# EAGLE design usbuddy (EAGLE 6.5.0)
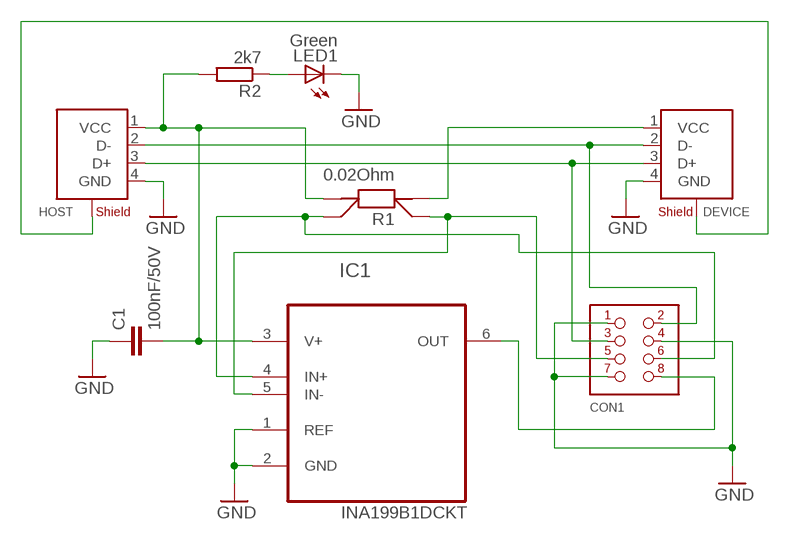
[diagram p0: schematic, sheet 1]

## Parts
C1  100nF/50V  C-EUC0603K  [C0603K]
CON1  PINHEAD-02X04-SMT-2.54  [2X04-SMT-PINHEAD]
DEVICE  USB-A-SMT  [USB-A-SMT-UBA-4R-S14HD-4S]
HOST  USB-B-SMT  [USB-B-SMT]
IC1  INA199A2DCKR  [SOT65P210X110-6N]
LED1  Green  LEDCHIP-LED0603  [CHIP-LED0603]
R1  0.02Ohm  LVK12  [1206-4WIRE]
R2  2k7  R-EU_R1206  [R1206]

## Nets
D+: CON1.3 DEVICE.3(D+) HOST.3(D+)
D-: CON1.2 DEVICE.2(D-) HOST.2(D-)
GND: C1.1 CON1.1 CON1.4 CON1.7 DEVICE.4(GND) HOST.4(GND) IC1.1(REF) IC1.2(GND) LED1.C
N$2: CON1.5 IC1.5(IN-) R1.V1
N$3: CON1.8 IC1.6(OUT)
N$8: DEVICE.1(VCC) R1.I1
N$9: CON1.6 IC1.4(IN+) R1.V2
N$10: LED1.A R2.1
SHIELD: DEVICE.S1(SHIELD) DEVICE.S2(SHIELD) DEVICE.S3(SHIELD) DEVICE.S4(SHIELD) HOST.S1(SHIELD) HOST.S2(SHIELD)
VBUS: C1.2 HOST.1(VCC) IC1.3(V+) R1.I2 R2.2

## Library data of the parts
C1 = rcl:C-EU: CAPACITOR, European symbol
CON1 = konektory:PINHEAD-02X04-SMT-2.54
DEVICE = konektory:USB-A-SMT: JST UBA-4R-S14HD-4S
HOST = konektory:USB-B-SMT: Tyco Electronics / TE connectivity 1734346
IC1 = Texas Instruments_By_element14_Batch_1:INA199A2DCKR: CURRENT SHUNT MONITOR; MPN: INA199B1DCKT; OC_FARNELL: -; OC_NEWARK: 74R6385; PACKAGE: SC70-6; SUPPLIER: Texas Instruments
LED1 = led:LED: LED OSRAM: - CHIPLED LG R971, LG N971, LY N971, LG Q971, LY Q971, LO R971, LY R971 LH N974, LH R974 LS Q976, LO Q976, LY Q976 LO Q996 - Hyper CHIPLED LW Q18S LB Q993, LB Q99A, LB R99A - SideLED LS A670, LO A670, LY A670, LG A670, LP A670 LB A673, LV A673, LT A673, LW A673 LH A674 LY A675 LS A676, LA A676, LO A676, LY A676, LW A676 LS A679, LY A679, LG A679 - Hyper Micro SIDELED® LS Y876, LA Y876, LO Y876, LY Y876 LT Y87S - SmartLED LW L88C, LW L88S LB L89C, LB L89S, LG L890 LS L89K, LO L89K, LY L89K LS L896, LA L896, LO L896, LY L896 - TOPLED LS T670, LO T670, LY T670, LG T670, LP T670 LSG T670, LSP T670, LSY T670, LOP T670, LYG T670 LG T671, LOG T671, LSG T671 LB T673, LV T673, LT T673, LW T673 LH T674 LS T676, LA T676, LO T676, LY T676, LB T676, LH T676, LSB T676, LW T676 LB T67C, LV T67C, LT T67C, LS T67K, LO T67K, LY T67K, LW E67C LS E67B, LA E67B, LO E67B, LY E67B, LB E67C, LV E67C, LT E67C LW T67C LS T679, LY T679, LG T679 LS T770, LO T770, LY T770, LG T770, LP T770 LB T773, LV T773, LT T773, LW T773 LH T774 LS E675, LA E675, LY E675, LS T675 LS T776, LA T776, LO T776, LY T776, LB T776 LHGB T686 LT T68C, LB T68C - Hyper Mini TOPLED® LB M676 - Mini TOPLED Santana® LG M470 LS M47K, LO M47K, LY M47K Source: http://www.osram.convergy.de LUXEON: - LUMILED® LXK2-PW12-R00, LXK2-PW12-S00, LXK2-PW14-U00, LXK2-PW14-V00 LXK2-PM12-R00, LXK2-PM12-S00, LXK2-PM14-U00 LXK2-PE12-Q00, LXK2-PE12-R00, LXK2-PE12-S00, LXK2-PE14-T00, LXK2-PE14-U00 LXK2-PB12-K00, LXK2-PB12-L00, LXK2-PB12-M00, LXK2-PB14-N00, LXK2-PB14-P00, LXK2-PB14-Q00 LXK2-PR12-L00, LXK2-PR12-M00, LXK2-PR14-Q00, LXK2-PR14-R00 LXK2-PD12-Q00, LXK2-PD12-R00, LXK2-PD12-S00 LXK2-PH12-R00, LXK2-PH12-S00 LXK2-PL12-P00, LXK2-PL12-Q00, LXK2-PL12-R00 Source: www.luxeon.com KINGBRIGHT: KA-3528ASYC Source: www.kingbright.com
R1 = pasivni:LVK12: Current shunt resistor Ohmite LVK12 series
R2 = rcl:R-EU_: RESISTOR, European symbol

## Board
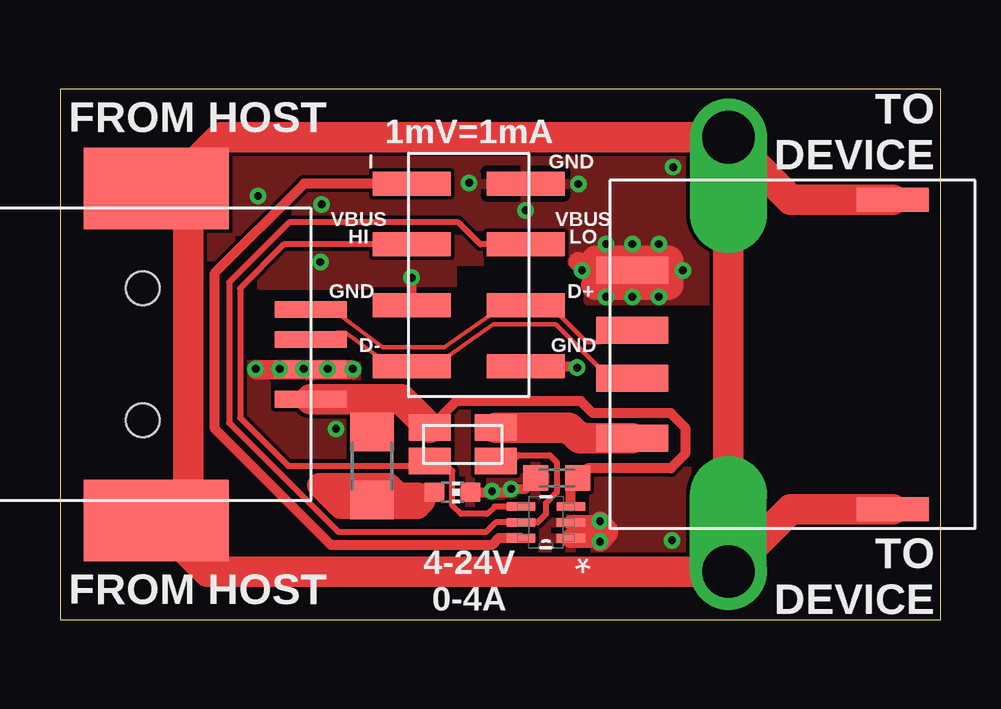
[diagram p1: board, top side]
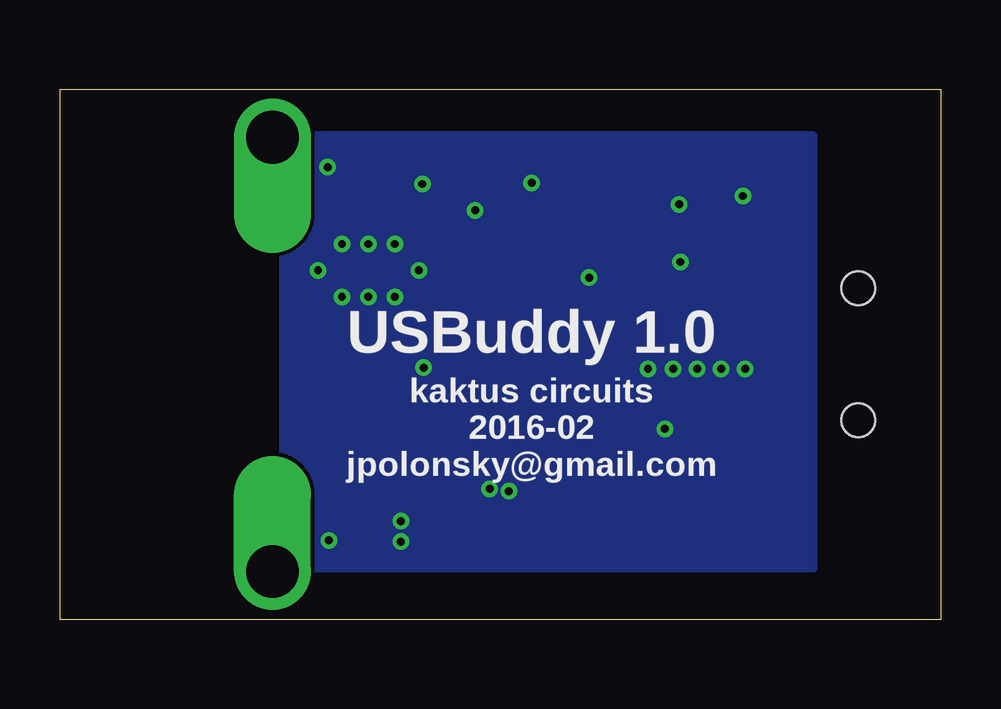
[diagram p2: board, bottom side, seen from below]

Size 36.7 x 22.1 mm. Coordinates in mm from the lower left corner, seen from the top.
Outline: 36.7,22.1 0,22.1 0,0 36.7,0 36.7,22.1
Copper layers (1*16): Top 0.0356mm / dielectric 1.5011mm / Bottom 0.0356mm
Design rules "LaenPCBOrder-2layer *": minimum track width 6mil, minimum drill 13mil, track to track 6mil, track to pad 6mil, pad to pad 6mil, via to via 6mil, smd to smd 6mil, copper to edge 15mil, drill to drill 6mil, minimum pad ring 7mil, minimum via ring 7mil, stop-mask expansion 3mil, vias tented up to drill 14mil, thermal gap 10mil

### Footprints (pad centres in the part's own frame; a part is rotated, then mirrored left to right if it is on the bottom)
C0603K = smd 1.05 x 1.08: 1 -0.875,0; 2 0.875,0
2X04-SMT-PINHEAD = smd 1 x 3.25: 1 -3.8,-2.35; 2 -3.8,2.4; 3 -1.26,-2.35; 4 -1.26,2.4; 5 1.28,-2.35; 6 1.28,2.4; 7 3.82,-2.35; 8 3.82,2.4
USB-A-SMT-UBA-4R-S14HD-4S = smd 1.12 x 3: 1 -3.5,4; 2 -1,4; 3 1,4; 4 3.5,4 | drill 2.2 offset: S1 -9.05,0; S2 9.05,0 | smd 1 x 3: S3 -6.45,-6.85; S4 6.45,-6.85
USB-B-SMT = smd 3 x 0.7: 1 -5.84,1.87; 2 -5.84,-0.62; 3 -5.84,-1.87; 4 -5.84,0.62 | smd 6.04 x 3.4: S1 0.58,6.92; S2 0.58,-6.92 | hole 1.4: 1.16,2.75; 1.16,-2.75
SOT65P210X110-6N = smd 1.168 x 0.356: 1 -1.041,0.66; 2 -1.041,0; 3 -1.041,-0.66; 4 1.041,-0.66; 5 1.041,0; 6 1.041,0.66
CHIP-LED0603 = smd 0.8 x 0.8: A 0,-0.75; C 0,0.75
1206-4WIRE = smd 1.75 x 1.1: I1 -1.4,-0.7; I2 1.35,-0.7; V1 -1.4,0.7; V2 1.35,0.7
R1206 = smd 1.6 x 1.803: 1 -1.422,0; 2 1.422,0

### Placement (x,y rotation side)
C1  20.7,5.9 0 top
CON1  17.05,14.35 90 top
DEVICE  27.85,11.05 90 top
HOST  4.6,11.05 180 top
IC1  20.25,4.05 180 top
LED1  16.35,5.3 270 top
R1  16.75,7.3 180 top
R2  13,6.4 90 top

### Tracks (layer width: path | path; a pad name or v marks a point on that pad's centre or on a via)
D+
  Top 0.191: HOST.3 11.23,12.92 11.7,12.65 13.45,11.35 16,11.35 17.95,12.7 18.34,13.09 CON1.3 20.41,13.09 21.95,11.55 22.5,11.55 23,12.05 DEVICE.3
D-
  Top 0.191: HOST.2 11.27,11.67 11.55,11.95 11.9,11.95 13.25,10.95 13.55,10.55 CON1.2 15.75,10.55 16.2,11 18.05,12.3 20.65,12.3 22.9,10.05 DEVICE.2
GND  (via drill 0.33)
  Top 0.406: LED1.C 18.65,5.3 v18.8,5.45 19.38,5.45 C1.1 | v22.75,13.45 22.75,14.55 22.35,14.95 | CON1.1 21.5,10.55 v21.55,10.5 | CON1.4 v14.65,14.25 | 22.35,13.95 22.35,14.15 21.8,14.7
  Top 0.61: IC1.2 22.45,4.05 v22.5,4.1
  Top 0.813: IC1.1 22.36,3.39 v22.5,3.25 22.85,3.6 22.85,3.75 v22.5,4.1 | 8.2,10.4 12.15,10.4 | 21.6,14.9 21.8,14.7 22.2,14.3
  Top 1.27: 22.35,14.95 25.35,14.95 25.35,13.95 22.35,13.95
  other vias: 21.75,14.55 25.95,14.55 24.95,13.45 23.85,13.45 24.95,15.65 23.85,15.65 22.75,15.65 8.15,10.45 21.6,18.15 17.05,18.2 19.4,17.05 10.85,14.9 25.55,18.85 25.5,3.3 8.25,17.65 10.9,17.3 9.15,10.45 10.15,10.45 11.15,10.45 12.2,10.45 11.5,7.95 18,5.35
  pour Top: 27.35,2.15 27.35,7.95 21.35,7.95 21.35,9.05 12.35,9.05 12.35,10.6 5.7,10.6 5.7,9.9 5.35,9.05 5.35,2.15
  pour Bottom: 27.35,2.15 27.35,20.15 5.35,20.15 5.35,2.15
  pour Top: 27.35,13.3 27.35,22.15 5.35,22.15 5.35,14.6 8.35,14.6 8.35,13.95 16.35,13.95 16.35,14.95 22,14.95 22,13.3
N$2
  Top 0.254: R1.V1 18.85,6.6 19.1,6.85 20.4,6.85 20.7,6.55 20.7,5.3 20.25,4.85 20.25,4.4 19.9,4.05 IC1.5 18.15,4.05 17.75,3.65 11.6,3.65 7.05,8.2 7.05,14.05 9.55,16.55 16.6,16.55 17.52,15.63 CON1.5
N$3
  Top 0.406: CON1.8 10.17,18.17 6.45,14.45 6.45,7.95 10.6,3.8 11.11,3.29 11.3,3.1 18,3.1 18.29,3.39 IC1.6
N$8
  Top 1.27: R1.I1 21.2,8 21.65,7.55 DEVICE.1
N$9
  Top 0.254: CON1.6 9.33,15.63 7.5,13.8 7.5,8.4 9.5,6.4 15.5,6.4 | IC1.4 18.11,4.71 17.8,4.4 16.7,4.4 16.35,4.75 16.35,6.2 16.15,6.4 15.5,6.4 | R1.V2 15.4,6.5 15.5,6.4
N$10
  Top 0.813: LED1.A 15.3,5.3 15,5
  Top 1.016: 14.9,5 14.9,4.7 11.7,4.7 10.8,5.6 13.7,5.6 14.1,5.2 14.9,5.2 14.9,5 | 15,5 14.9,5
  Top 1.27: R2.1 14.98,4.98 15,5
SHIELD
  Top 1.27: DEVICE.S1 6.15,2 HOST.S1 4.33,4.13 5.35,5.15 5.35,18.15 | DEVICE.S2 DEVICE.S1 | DEVICE.S4 30.45,17.5 DEVICE.S2 | DEVICE.S3 30.45,4.6 DEVICE.S1 | DEVICE.S2 6.7,20.1 4.57,17.97 HOST.S2
VBUS
  Top 0.406: IC1.3 21.29,5.62 C1.2 21.98,6.3 25.45,6.3 26.05,6.9 26.05,8 25.45,8.6 22.2,8.6 21.7,9.1 16.5,9.1 R1.I2
  Top 1.27: HOST.1 13,9.18 | 13,9.18 14.22,9.18 R1.I2 | R2.2 13,9.18

### Text on the board
tPlace: 1mV=1mA | FROM HOST | I | GND | TO / DEVICE | VBUS / HI | VBUS / LO | GND | D+ | D- | GND | 4-24V / 0-4A | TO / DEVICE | FROM HOST
bPlace: USBuddy 1.0 | kaktus circuits / 2016-02 / jpolonsky@gmail.com